# EAGLE design vbat_board (EAGLE 7.2.0)
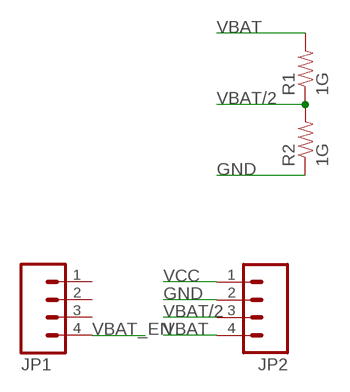
[diagram p0: schematic, sheet 1]

## Parts
JP1  M04PTH  [1X04]
JP2  M04PTH  [1X04]
R1  1G  RESISTORAXIAL-0.3  [AXIAL-0.3]
R2  1G  RESISTORAXIAL-0.3  [AXIAL-0.3]

## Nets
GND: JP2.2 R2.P$1
VBAT: JP2.4 R1.P$2
VBAT/2: JP2.3 R1.P$1 R2.P$2
VBAT_EN: JP1.4
VCC: JP2.1
Unconnected: JP1.1 JP1.2 JP1.3

## Library data of the parts
JP1 JP2 = SparkFun-Connectors:M04: Header 4 Standard 4-pin 0.1" header. Use with straight break away headers (SKU : PRT-00116), right angle break away headers (PRT-00553), swiss pins (PRT-00743), machine pins (PRT-00117), and female headers (PRT-00115). Molex polarized connector foot print use with SKU : PRT-08231 with associated crimp pins and housings. 1MM SMD Version SKU: PRT-10208
R1 R2 = SparkFun-Resistors:RESISTOR: Resistor Basic schematic elements and footprints for 0603, 1206, and PTH resistors.

## Board
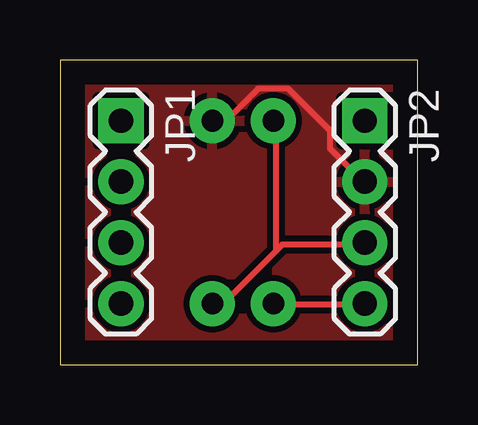
[diagram p1: board, top side]
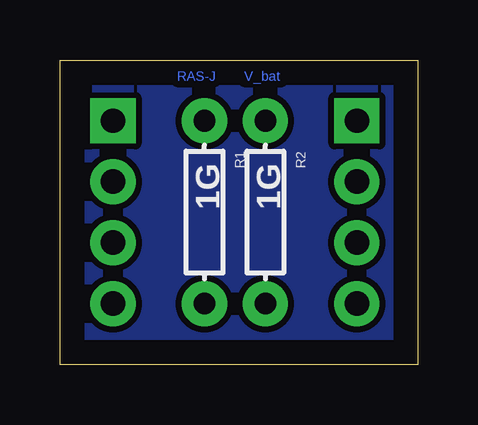
[diagram p2: board, bottom side, seen from below]

Size 14.91 x 12.69 mm. Coordinates in mm from the lower left corner, seen from the top.
Outline: 0,0 14.91,0 14.91,12.69 0,12.69 0,0
Copper layers (1*16): Top 0.035mm / dielectric 1.5mm / Bottom 0.035mm
Design rules "UoM_design_rules": minimum track width 0.25mm, minimum drill 0.3mm, track to track 0.25mm, track to pad 0.25mm, pad to pad 0.25mm, via to via 0.25mm, smd to smd 8mil, copper to edge 40mil, drill to drill 8mil, minimum pad ring 10mil, minimum via ring 8mil, stop-mask expansion 4mil, vias tented up to drill 0mil, thermal gap 10mil

### Footprints (pad centres in the part's own frame; a part is rotated, then mirrored left to right if it is on the bottom)
1X04 = drill 1.016 pad 1.88 square: 1 0,0 | drill 1.016 pad 1.88: 2 2.54,0; 3 5.08,0; 4 7.62,0
AXIAL-0.3 = drill 0.9 pad 1.88: P$1 -3.81,0; P$2 3.81,0

### Placement (x,y rotation side)
JP1  2.54,10.16 270 top
JP2  12.7,10.16 270 top
R1  8.89,6.35 270 bottom
R2  6.35,6.35 270 bottom

### Tracks (layer width: path | path; a pad name or v marks a point on that pad's centre or on a via)
GND
  Top 0.25: R2.P$1 6.5,10.25 7,10.25 8.25,11.5 9.5,11.5 11.25,9.75 11.25,9 12.5,7.75 JP2.2
  pour Top: 0,12.7 15.24,12.7 15.24,0 0,0
N$1
  pour Bottom: 0,12.7 14.99,12.7 14.99,0 0,0
VBAT
  Top 0.25: R1.P$2 9,2.5 12.5,2.5 JP2.4
VBAT/2
  Top 0.25: 9,4.75 9.25,5 12.5,5 JP2.3 | 9,4.75 7,2.75 6.5,2.75 R2.P$2 | 9,4.75 9,10 R1.P$1

### Text on the board
Bottom: V_bat | RAS-J